# EAGLE design IR (EAGLE 7.1.0)
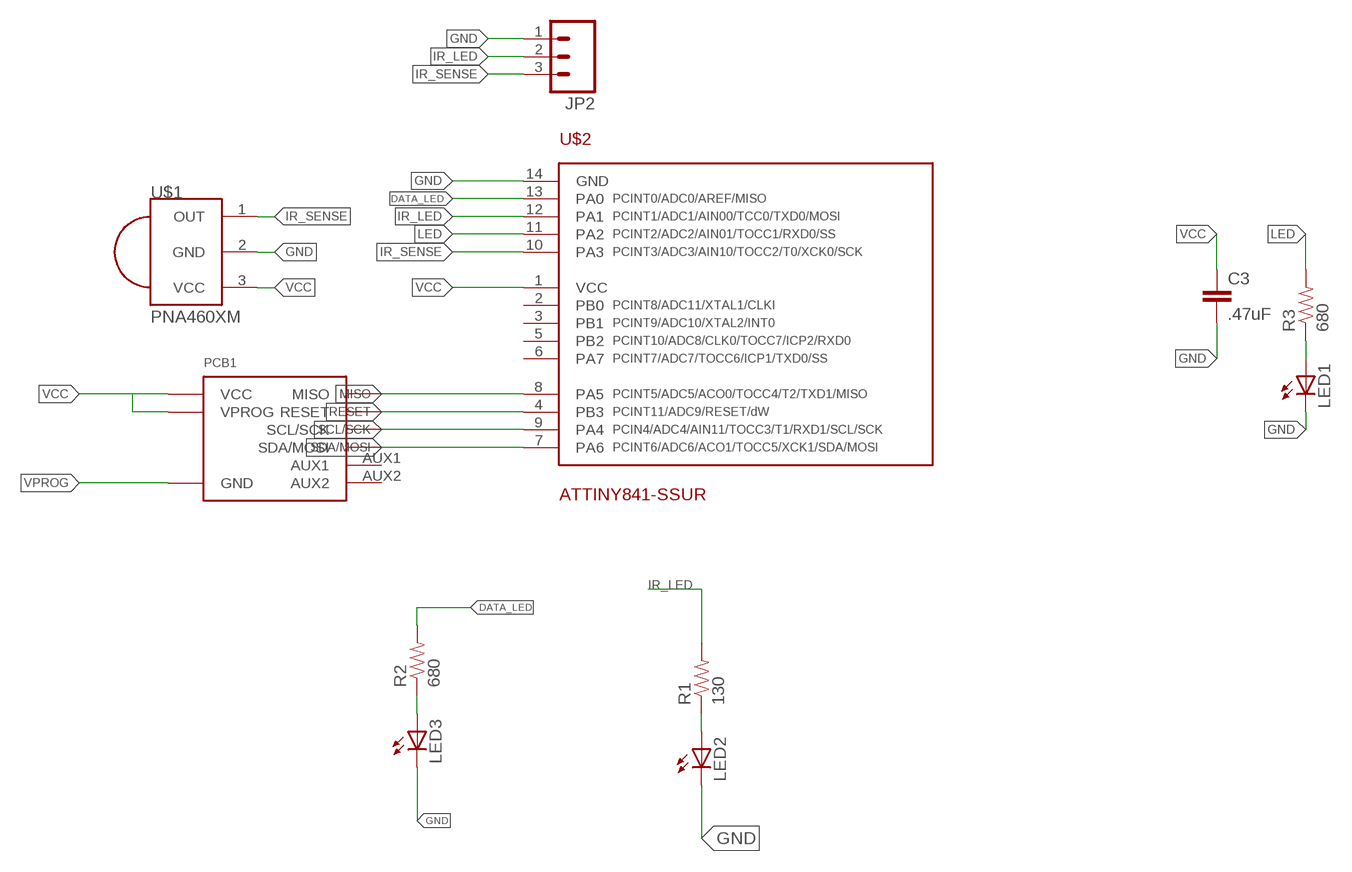
[diagram p0: schematic, sheet 1]

## Parts
C3  .47uF  CAP0805  [0805]
JP2  M03PTH  [1X03]
LED1  LEDCHIP-LED0805  [CHIP-LED0805]
LED2  LED5MM  [LED5MM]
LED3  LEDCHIP-LED0805  [CHIP-LED0805]
PCB1  MAGDEVICE-V2  [MAGDEVICE-V2]
R1  130  RESISTOR0805  [0805]
R2  680  RESISTOR0805  [0805]
R3  680  RESISTOR0805  [0805]
U$1  PNA460XM  [PNA460XM]
U$2  ATTINY841-SSUR  ATTINY841  [SOIC-14]

## Nets
DATA_LED: R2.2 U$2.13(PA0)
GND: C3.2 JP2.1 LED1.C LED2.K(C) LED3.C U$1.2(GND) U$2.14(GND)
IR_LED: JP2.2 R1.2 U$2.12(PA1)
IR_SENSE: JP2.3 U$1.1(OUT) U$2.10(PA3)
LED: R3.2 U$2.11(PA2)
MISO: PCB1.MISO U$2.8(PA5)
N$1: LED3.A R2.1
N$2: LED1.A R3.1
N$3: LED2.A R1.1
RESET: PCB1.RESET U$2.4(PB3)
SCL/SCK: PCB1.SCL(SCL/SCK) U$2.9(PA4)
SDA/MOSI: PCB1.SDA(SDA/MOSI) U$2.7(PA6)
VCC: C3.1 PCB1.VCC PCB1.VPROG U$1.3(VCC) U$2.1(VCC)
VPROG: PCB1.GND
Unconnected: PCB1.AUX1 PCB1.AUX2 U$2.2(PB0) U$2.3(PB1) U$2.5(PB2) U$2.6(PA7)

## Library data of the parts
C3 = IntegerLabs:CAP: Capacitor
JP2 = SparkFun-Connectors:M03: Header 3 Standard 3-pin 0.1" header. Use with straight break away headers (SKU : PRT-00116), right angle break away headers (PRT-00553), swiss pins (PRT-00743), machine pins (PRT-00117), and female headers (PRT-00115). Molex polarized connector foot print use with SKU : PRT-08232 with associated crimp pins and housings.
LED1 LED3 = adafruit:LED: LED OSRAM: - CHIPLED LG R971, LG N971, LY N971, LG Q971, LY Q971, LO R971, LY R971 LH N974, LH R974 LS Q976, LO Q976, LY Q976 LO Q996 - Hyper CHIPLED LW Q18S LB Q993, LB Q99A, LB R99A - SideLED LS A670, LO A670, LY A670, LG A670, LP A670 LB A673, LV A673, LT A673, LW A673 LH A674 LY A675 LS A676, LA A676, LO A676, LY A676, LW A676 LS A679, LY A679, LG A679 - Hyper Micro SIDELED® LS Y876, LA Y876, LO Y876, LY Y876 LT Y87S - SmartLED LW L88C, LW L88S LB L89C, LB L89S, LG L890 LS L89K, LO L89K, LY L89K LS L896, LA L896, LO L896, LY L896 - TOPLED LS T670, LO T670, LY T670, LG T670, LP T670 LSG T670, LSP T670, LSY T670, LOP T670, LYG T670 LG T671, LOG T671, LSG T671 LB T673, LV T673, LT T673, LW T673 LH T674 LS T676, LA T676, LO T676, LY T676, LB T676, LH T676, LSB T676, LW T676 LB T67C, LV T67C, LT T67C, LS T67K, LO T67K, LY T67K, LW E67C LS E67B, LA E67B, LO E67B, LY E67B, LB E67C, LV E67C, LT E67C LW T67C LS T679, LY T679, LG T679 LS T770, LO T770, LY T770, LG T770, LP T770 LB T773, LV T773, LT T773, LW T773 LH T774 LS E675, LA E675, LY E675, LS T675 LS T776, LA T776, LO T776, LY T776, LB T776 LHGB T686 LT T68C, LB T68C - Hyper Mini TOPLED® LB M676 - Mini TOPLED Santana® LG M470 LS M47K, LO M47K, LY M47K Source: http://www.osram.convergy.de/
LED2 = SparkFun-LED:LED: LEDs Standard schematic elements and footprints for 5mm, 3mm, 1206, and 0603 sized LEDs. 5mm - Spark Fun Electronics SKU : COM-00529 (and others)
PCB1 = Modulo:MAGDEVICE
R1-R3 = IntegerLabs:RESISTOR: Resistor Basic schematic elements and footprints for 0603, 1206, and PTH resistors.
U$1 = adafruit:PNA460XM: IR 38KHz receiver PNA4602 and related receivers http://www.ladyada.net/library/pcb/eaglelibrary.html
U$2 = Modulo:ATTINY841

## Board
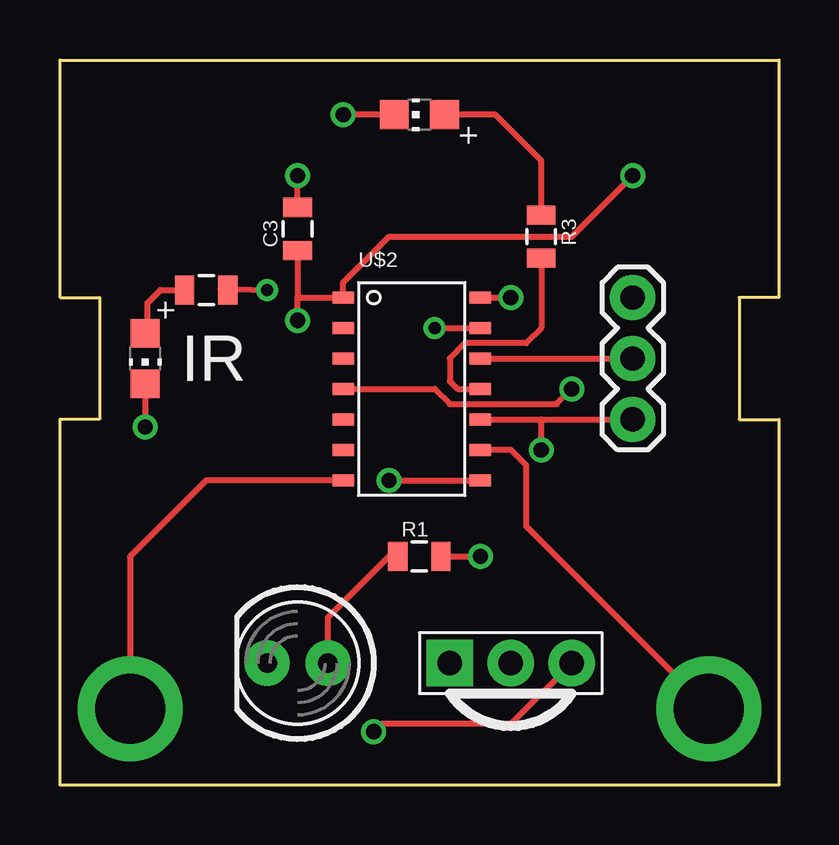
[diagram p1: board, top side]
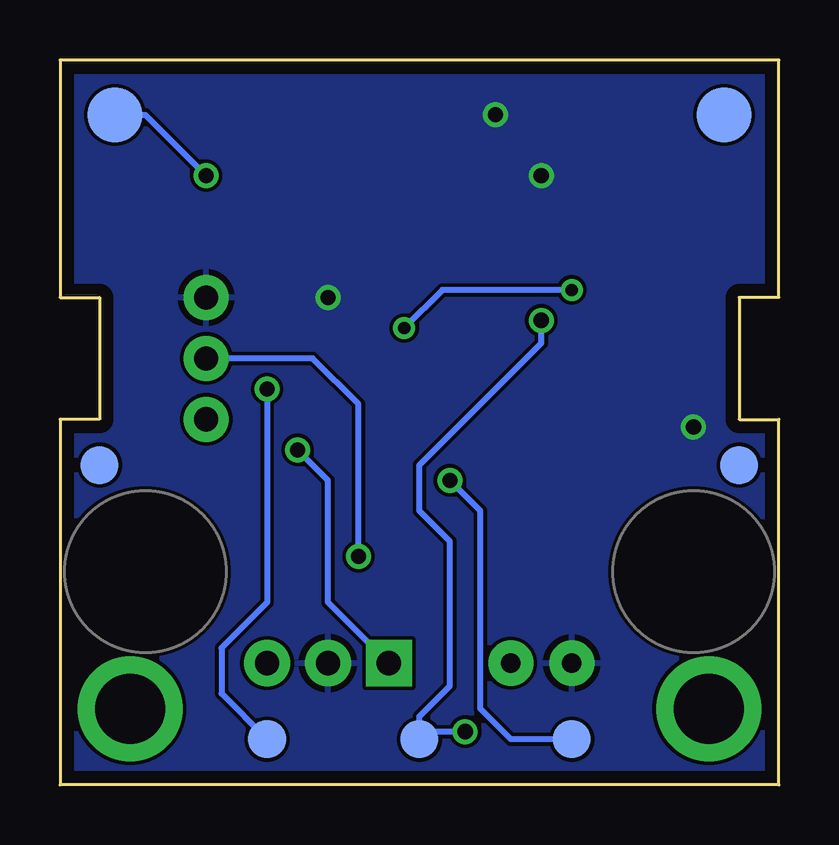
[diagram p2: board, bottom side, seen from below]

Size 29.97 x 30.23 mm. Coordinates in mm from the lower left corner, seen from the top.
Copper layers (1*16): Top 0.0178mm / dielectric 59mil / Bottom 0.0178mm
Design rules "SSC-EAGLE-2Lyr_v1.0.0.3": minimum track width 6mil, minimum drill 14mil, track to track 6mil, track to pad 6mil, pad to pad 6mil, via to via 6mil, smd to smd 6mil, copper to edge 20mil, drill to drill 16mil, minimum pad ring 8mil, minimum via ring 8mil, stop-mask expansion 3mil, vias tented up to drill 0mil, thermal gap 10mil

### Footprints (pad centres in the part's own frame; a part is rotated, then mirrored left to right if it is on the bottom)
0805 = smd 0.8 x 1.2: 1 -0.9,0; 2 0.9,0
1X03 = drill 1.016 pad 1.88: 1 0,0; 2 2.54,0; 3 5.08,0
CHIP-LED0805 = smd 1.2 x 1.2: A 0,-1.05; C 0,1.05
LED5MM = drill 0.813 pad 1.88: A -1.27,0; K 1.27,0
MAGDEVICE-V2 = smd 1.587 x 1.587 bottom: AUX1 1.905,13.335; AUX2 28.575,13.335; MISO 8.89,1.905; RESET 21.59,1.905; VPROG 15.24,1.905 | smd 2.286 x 2.286 bottom: GND 2.54,27.94; VCC 27.94,27.94 | drill 2.921: SCL 27.305,3.175; SDA 3.175,3.175
PNA460XM = drill 1.016 pad 1.93 square: 1 -2.54,0 | drill 1.016 pad 1.93: 2 0,0; 3 2.54,0
SOIC-14 = smd 0.508 x 0.889: 1 0,-3.175; 2 1.27,-3.175; 3 2.54,-3.175; 4 3.81,-3.175; 5 5.08,-3.175; 6 6.35,-3.175; 7 7.62,-3.175; 8 7.62,2.54; 9 6.35,2.54; 10 5.08,2.54; 11 3.81,2.54; 12 2.54,2.54; 13 1.27,2.54; 14 0,2.54

### Placement (x,y rotation side)
C3  9.91,23.18 90 top
JP2  23.88,20.32 270 top
LED1  14.99,27.94 90 top
LED2  9.91,5.08 180 top
LED3  3.56,17.78 180 top
PCB1  -0.25,0 0 top
R1  14.99,9.53 0 top
R2  6.1,20.64 0 top
R3  20.07,22.86 270 top
U$1  18.8,5.08 0 top
U$2  14.99,20.32 270 top

### Tracks (layer width: path | path; a pad name or v marks a point on that pad's centre or on a via)
DATA_LED  (via drill 0.51 pad 0.25)
  Top 0.254: R2.2 6.68,20.69 v8.64,20.64 | v15.62,19.05 U$2.13
  Bottom 0.254: v8.64,20.64 14.03,20.64 v15.62,19.05
GND  (via drill 0.64)
  Top 0.254: U$2.14 v18.8,20.32 | LED3.C v3.56,14.92 | C3.2 v9.91,25.4 | LED1.C v11.81,27.94
  pour Bottom: -7.24,-0.64 30.23,-0.64 30.23,30.48 -7.24,30.48
IR_LED  (via drill 0.64)
  Top 0.254: U$2.12 JP2.2 | R1.2 v17.53,9.53
  Bottom 0.254: v17.53,9.53 17.53,15.88 19.43,17.78 JP2.2
IR_SENSE  (via drill 0.64)
  Top 0.254: U$2.10 20.07,15.24 | 20.07,15.24 JP2.3 | v20.07,13.97 20.07,15.24
  Bottom 0.254: U$1.1 18.8,7.62 18.8,12.7 v20.07,13.97
LED
  Top 0.254: R3.2 20.07,19.05 19.43,18.41 16.89,18.41 16.26,17.78 16.26,16.83 16.57,16.51 U$2.11
MISO  (via drill 0.64)
  Top 0.254: v13.72,12.7 U$2.8
  Bottom 0.254: PCB1.MISO 11.18,1.91 12.45,3.17 12.45,11.43 v13.72,12.7
N$1
  Top 0.254: LED3.A 3.65,19.05 3.65,20.1 4.19,20.64 R2.1
N$2
  Top 0.254: R3.1 20.07,26.04 18.16,27.94 LED1.A
N$3
  Top 0.254: LED2.A 11.18,6.99 13.72,9.53 R1.1
RESET  (via drill 0.64)
  Top 0.254: U$2.4 15.62,16.51 16.26,15.88 20.7,15.88 v21.34,16.51
  Bottom 0.254: v21.34,16.51 21.34,7.62 23.24,5.71 23.24,3.81 PCB1.RESET
SCL/SCK
  Top 0.254: U$2.9 18.8,13.97 19.43,13.34 19.43,10.79 PCB1.SCL
SDA/MOSI
  Top 0.254: U$2.7 6.1,12.7 2.92,9.53 PCB1.SDA
VCC  (via drill 0.64)
  Top 0.254: v23.88,25.4 21.34,22.86 13.72,22.86 11.81,20.95 U$2.1 9.91,20.32 | U$1.3 18.8,2.54 13.4,2.54 v13.08,2.22 | C3.1 9.91,20.32 | v9.91,19.37 9.91,20.32
  Bottom 0.254: PCB1.VCC 26.42,27.94 v23.88,25.4 | v9.91,19.37 9.91,18.41 14.99,13.34 14.99,11.43 13.72,10.16 13.72,4.13 14.99,2.86 PCB1.VPROG 14.67,2.22 v13.08,2.22

### Text on the board
tPlace: IR